# Altium schematic sheet Si7021.SchDoc: Si7021 Temperature and Humidity Sensor
size A4; Author: Sanju Prakash Kannioth; DrawnBy: Sanju Prakash Kannioth; Engineer: Sanju Prakash Kannioth; Revision: 1.0; SheetNumber: 9; SheetTotal: 10
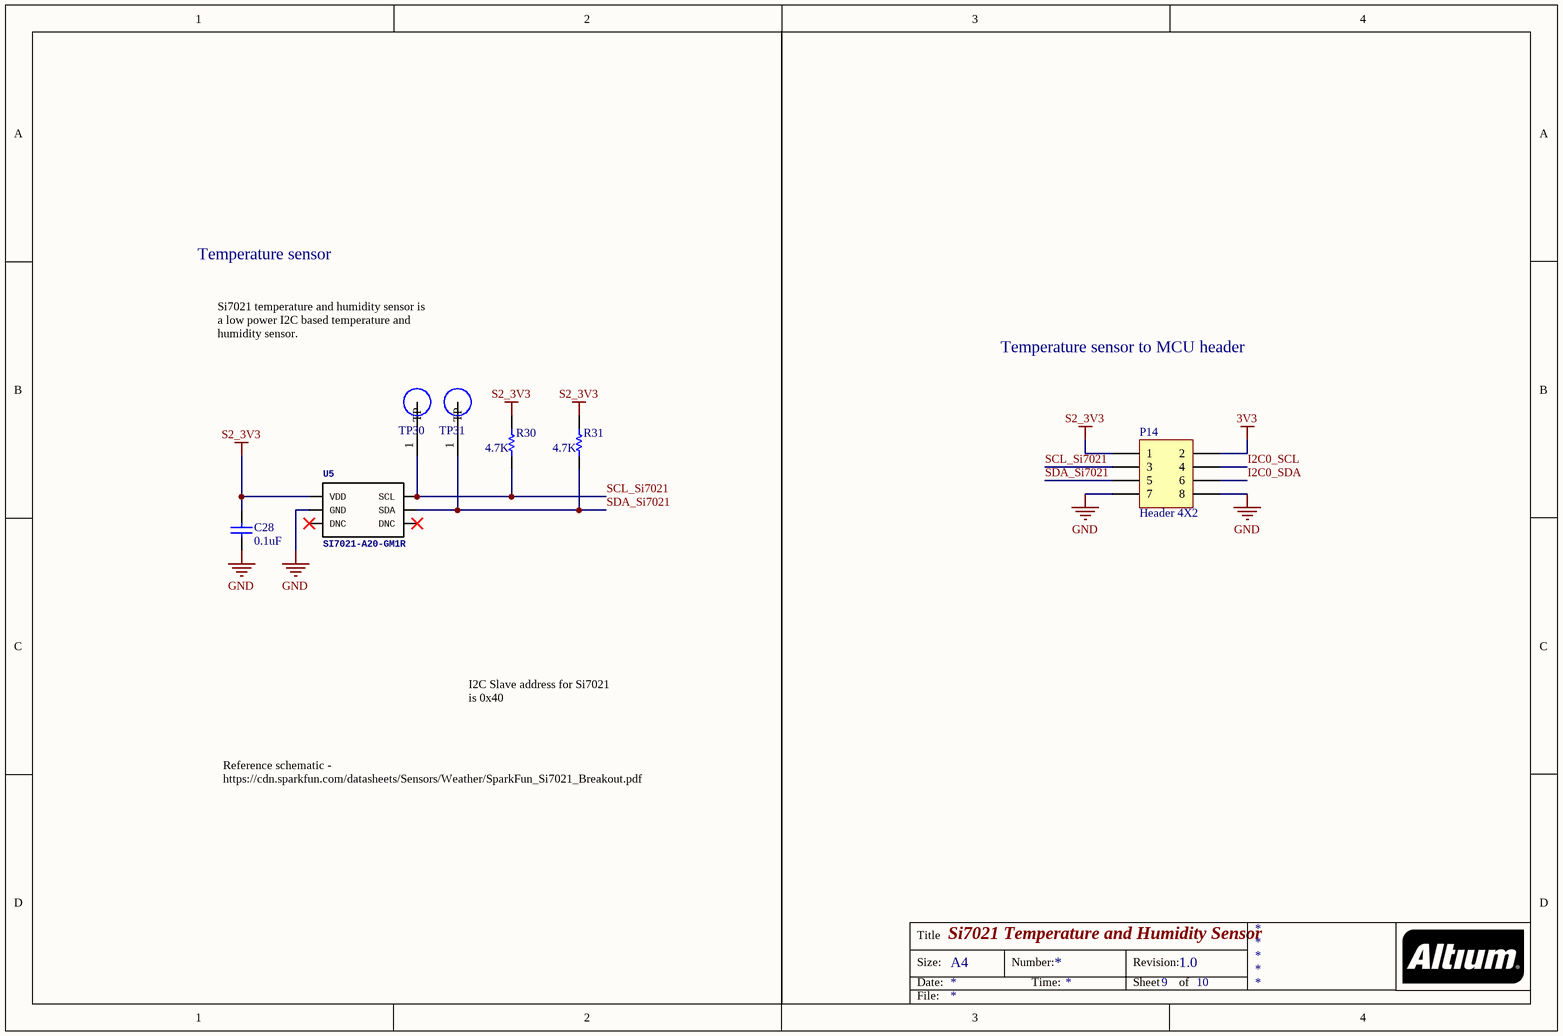
[diagram p0: Si7021.SchDoc]

## Parts
C28  value 0.1uF  [1608[0603]]  (hidden comment: Cap)
P14  Header 4X2  [4-PIN]
R30  value 4.7K  [1608[0603]]  (hidden comment: Res1)
R31  value 4.7K  [1608[0603]]  (hidden comment: Res1)
TP30  TP  [TP]  (value not drawn)
TP31  TP  [TP]  (value not drawn)
U5  SI7021-A20-GM1R  [SI7021]

## Nets
3V3: P14.2
GND: C28.1 P14.7 P14.8 U5.GND
S2_3V3: C28.2 P14.1 R30.2 R31.2 U5.VDD
I2C0_SCL: P14.4
I2C0_SDA: P14.6
SCL_Si7021: P14.3 R30.1 TP30.1(TP) U5.SCL
SDA_Si7021: P14.5 R31.1 TP31.1(TP) U5.SDA

Not connected (* = marked no-connect by the designer): U5 NC@3(DNC)* NC@4(DNC)*

## Notes on the sheet
- Temperature sensor
- Si7021 temperature and humidity sensor is a low power I2C based temperature and humidity sensor.
- Temperature sensor to MCU header
- I2C Slave address for Si7021 is 0x40
- Reference schematic - https://cdn.sparkfun.com/datasheets/Sensors/Weather/SparkFun_Si7021_Breakout.pdf
- Title
- Size:
- Date:
- A4
- Number:
- Time:
- Revision:
- Sheet
- of
- File:

## Library data of the parts
C28 = Cap: Capacitor; Manufacturer: Samsung Electro-Mechanics; Manufacturer Part Number: CL10B104KO8NNNC; Digi-Key Part Number: 1276-1005-1-ND; DigiKeyURL: https://www.digikey.com/product-detail/en/samsung-electro-mechanics/CL10B104KO8NNNC/1276-1005-1-ND/3889091
P14 = Header 4X2: Header, 4-Pin, Dual row; Manufacturer: TE Connectivity; Manufacturer Part Number: 5-146256-4; Digi-Key Part Number: A121467-ND; DigiKeyURL: https://www.digikey.com/product-detail/en/te-connectivity/5-146256-4/A121467-ND/2275818
R30 R31 = Res1: RES SMD 4.7K OHM 5% 1/10W 0603; Manufacturer: Yageo; Manufacturer Part Number: RC0603JR-074K7L; Digi-Key Part Number: 311-4.7KGRCT-ND; DigiKeyURL: https://www.digikey.com/product-detail/en/yageo/RC0603JR-074K7L/311-4.7KGRCT-ND/729732
TP30 TP31 = TP: PC TEST POINT MINIATURE; Manufacturer: Keystone Electronics; Manufacturer Part Number: 5019; Snapeda_Url: https://www.snapeda.com/parts/5019/Keystone%20Electronics/view-part/?ref=search&t=5019; DigiKeyURL: https://www.digikey.com/product-detail/en/keystone-electronics/5019/36-5019CT-ND/3907344?utm_source=snapeda&utm_medium=aggregator&utm_campaign=symbol; Digi-Key Part Number: 36-5019CT-ND
U5 = SI7021: SENS HUMID/TEMP 3.6V I2C 2% 6DFN; Manufacturer: Silicon Labs; Digi-Key Part Number: 336-4380-1-ND; Manufacturer Part Number: SI7021-A20-GM1R; DigiKeyURL: https://www.digikey.com/product-detail/en/silicon-labs/SI7021-A20-GM1R/336-4380-1-ND/8038299; Snapeda_URL: https://www.snapeda.com/parts/SI7021-A20-GM1R/Silicon%20Labs/view-part/?ref=search&t=SI7021-A20-GM1R